# EAGLE design DSLR_controller (EAGLE 7.0.0)
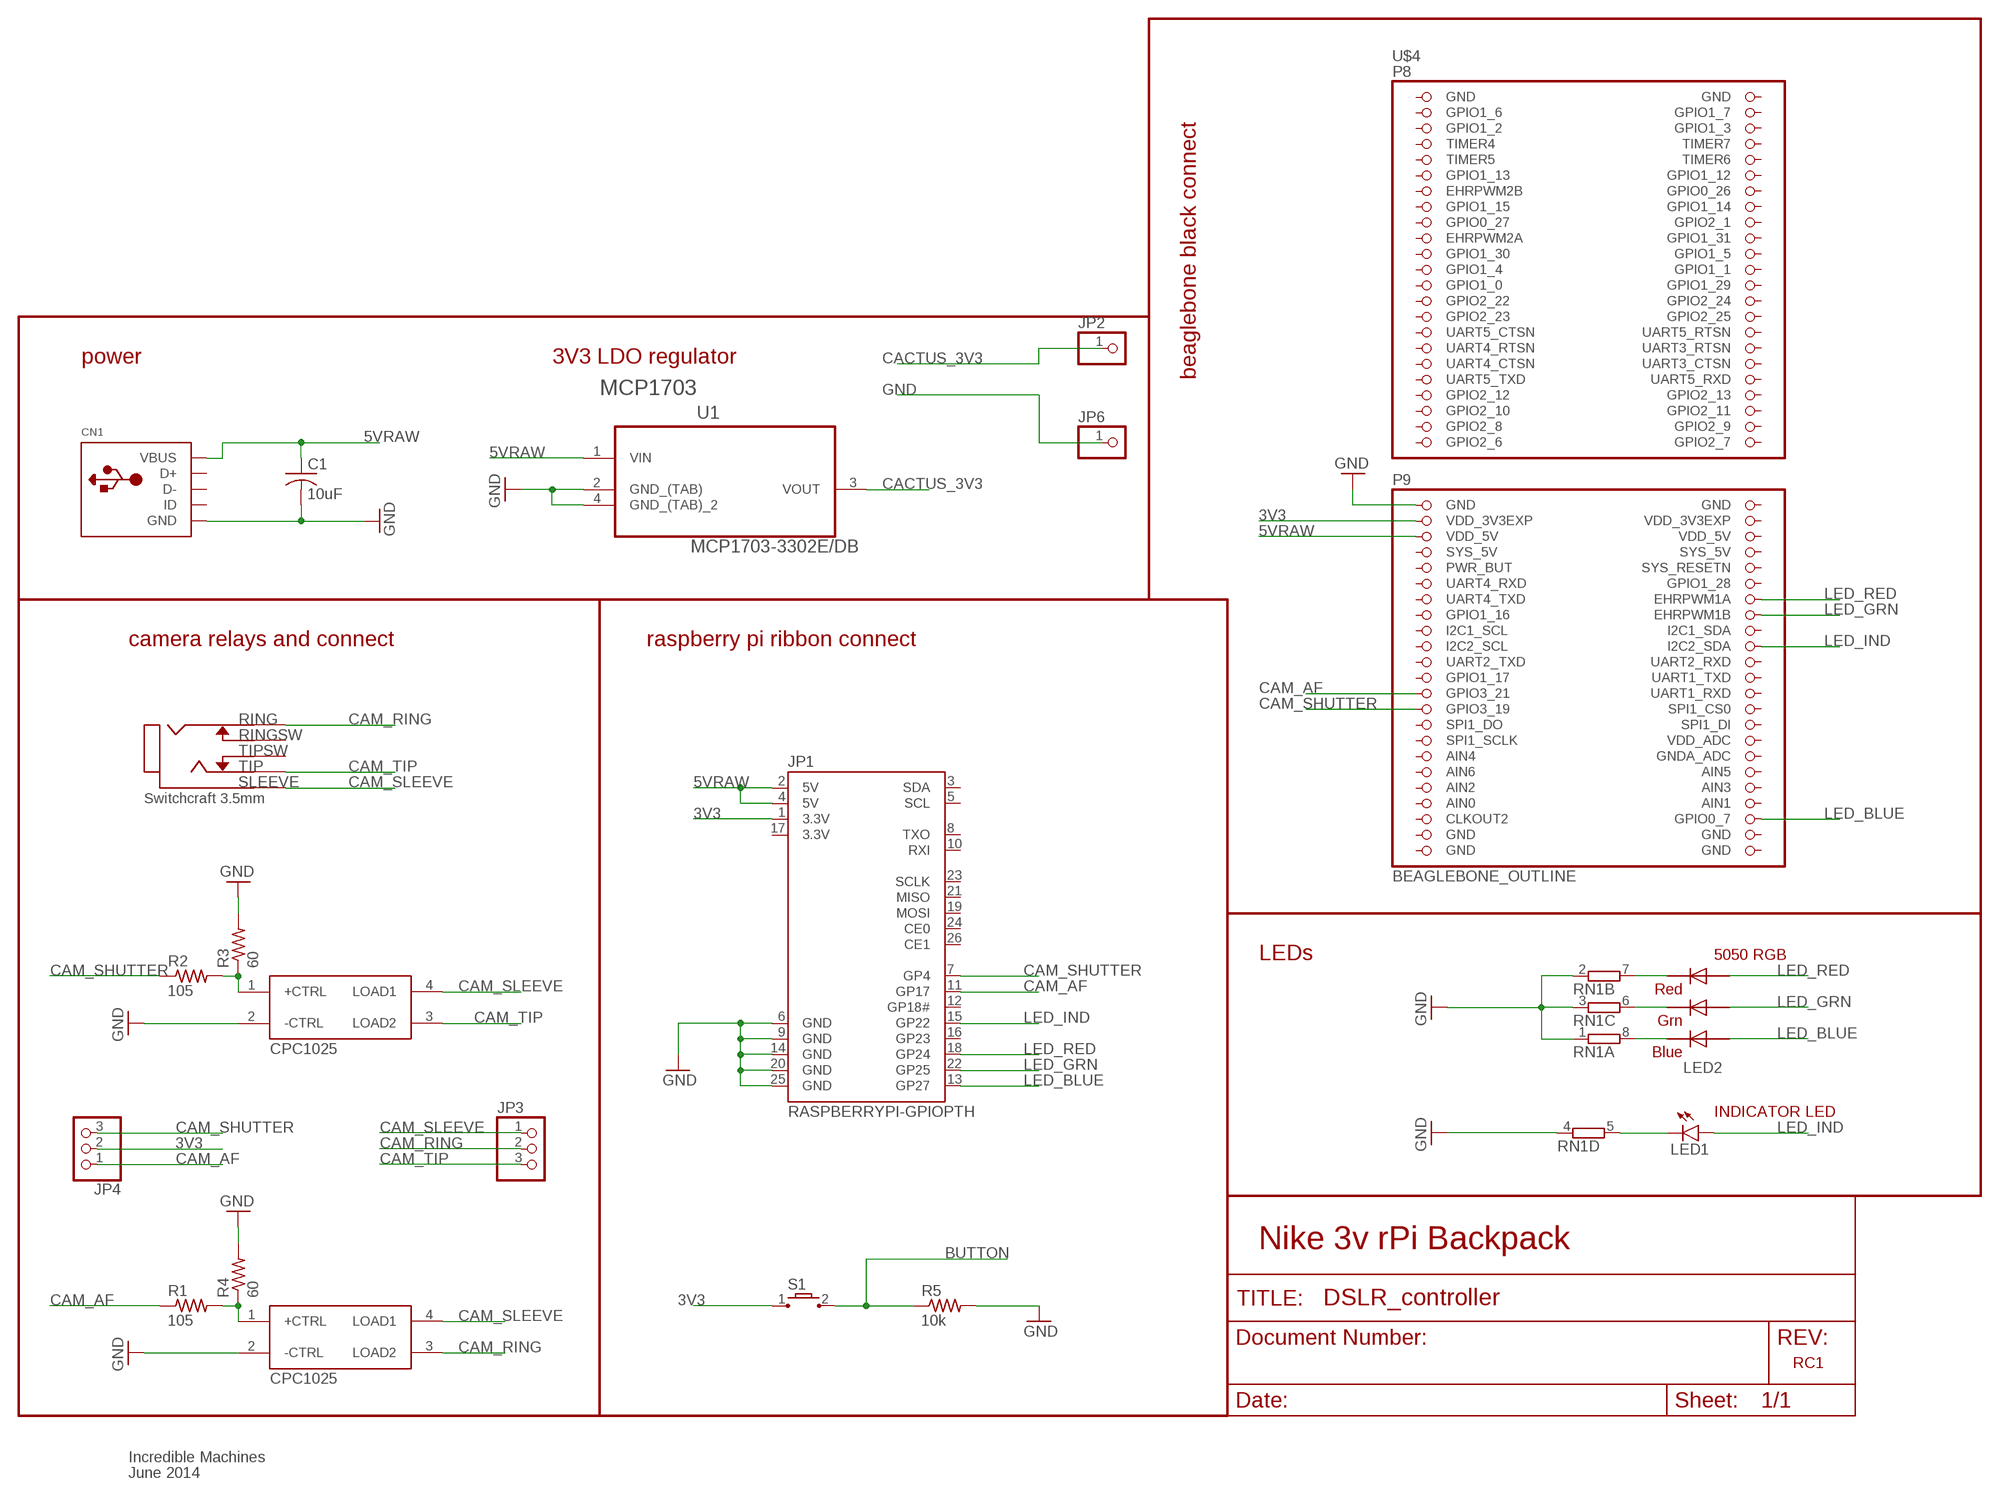
[diagram p0: schematic, sheet 1]

## Parts
C1  10uF  C-USC1206K  [C1206K]
CN1  USBMOLEX  [USB-MINIB-THM-MOLEX]
JP1  RASPBERRYPI-GPIOPTH  [2X13-SHROUDED]
JP2  PINHD-1X1CB  [1X01-CLEANBIG]
JP3  PINHD-1X3CB  [1X03-CLEANBIG]
JP4  PINHD-1X3CB  [1X03-CLEANBIG]
JP6  PINHD-1X1CB  [1X01-CLEANBIG]
LED1  LED1206  [LED-1206]
LED2  RGBLED5050  [RGBLED5050]
R1  105  R-US_R1206  [R1206]
R2  105  R-US_R1206  [R1206]
R3  60  R-US_R1206  [R1206]
R4  60  R-US_R1206  [R1206]
R5  10k  R-US_R1206  [R1206]
RN1  4R-NEXBS8V  [EXBS8V]
S1  TL3302-G  [TL3302_GULL_WING]
U1  MCP1703-3302E/DB  [SOT230P700X180-4N]
U$1  SWTCHCRFT_3.5JACK5-JACK-SMD  [4-JACK-SMD]
U$2  CPC1025_OPTORELAY  [4-OPTORELAY]
U$3  CPC1025_OPTORELAY  [4-OPTORELAY]
U$4  BEAGLEBONE_OUTLINE  [BEAGLEBONE_SHIELD]

## Nets
3V3: JP1.1(3.3V) JP4.2 S1.1 U$4.49(VDD_3V3EXP)
5VRAW: C1.1 CN1.VBUS JP1.2(5V) JP1.4(5V) U1.1(VIN) U$4.51(VDD_5V)
BUTTON: R5.1 S1.2
CACTUS_3V3: JP2.1 U1.3(VOUT)
CAM_AF: JP1.11(GP17) JP4.1 R1.1 U$4.71(GPIO3_21)
CAM_RING: JP3.2 U$1.2 U$2.3(LOAD2)
CAM_SHUTTER: JP1.7(GP4) JP4.3 R2.1 U$4.73(GPIO3_19)
CAM_SLEEVE: JP3.1 U$1.1 U$2.4(LOAD1) U$3.4(LOAD1)
CAM_TIP: JP3.3 U$1.3 U$3.3(LOAD2)
GND: C1.2 CN1.GND JP1.6(GND) JP1.9(GND) JP1.14(GND) JP1.20(GND) JP1.25(GND) JP6.1 R3.2 R4.2 R5.2 RN1.1 RN1.2 RN1.3 RN1.4 U1.2(GND_(TAB)) U1.4(GND_(TAB)_2) U$2.2(-CTRL) U$3.2(-CTRL) U$4.47(GND)
LED_BLUE: JP1.13(GP27) LED2.3(BLUE_A) U$4.88(GPIO0_7)
LED_GRN: JP1.22(GP25) LED2.1(GREEN_A) U$4.62(EHRPWM1B)
LED_IND: JP1.15(GP22) LED1.A U$4.66(I2C2_SDA)
LED_RED: JP1.18(GP24) LED2.2(RED_A) U$4.60(EHRPWM1A)
N$1: LED2.6(GREEN_C) RN1.6
N$2: LED2.5(RED_C) RN1.7
N$3: LED2.4(BLUE_C) RN1.8
N$4: LED1.C RN1.5
N$6: R1.2 R4.1 U$2.1(+CTRL)
N$7: R2.2 R3.1 U$3.1(+CTRL)
Unconnected: CN1.D+ CN1.D- CN1.ID JP1.3(SDA) JP1.5(SCL) JP1.8(TXO) JP1.10(RXI) JP1.12(GP18#) JP1.16(GP23) JP1.19(MOSI) JP1.21(MISO) JP1.23(SCLK) JP1.24(CE0) JP1.26(CE1) U$1.4 U$1.5 U$4.3(GPIO1_6) U$4.4(GPIO1_7) U$4.5(GPIO1_2) U$4.6(GPIO1_3) U$4.7(TIMER4) U$4.8(TIMER7) U$4.9(TIMER5) U$4.10(TIMER6) U$4.11(GPIO1_13) U$4.12(GPIO1_12) U$4.13(EHRPWM2B) U$4.14(GPIO0_26) U$4.15(GPIO1_15) U$4.16(GPIO1_14) U$4.17(GPIO0_27) U$4.18(GPIO2_1) U$4.19(EHRPWM2A) U$4.20(GPIO1_31) U$4.21(GPIO1_30) U$4.22(GPIO1_5) U$4.23(GPIO1_4) U$4.24(GPIO1_1) U$4.25(GPIO1_0) U$4.26(GPIO1_29) U$4.27(GPIO2_22) U$4.28(GPIO2_24) U$4.29(GPIO2_23) U$4.30(GPIO2_25) U$4.31(UART5_CTSN) U$4.32(UART5_RTSN) U$4.33(UART4_RTSN) U$4.34(UART3_RTSN) U$4.35(UART4_CTSN) U$4.36(UART3_CTSN) U$4.37(UART5_TXD) U$4.38(UART5_RXD) U$4.39(GPIO2_12) U$4.40(GPIO2_13) U$4.41(GPIO2_10) U$4.42(GPIO2_11) U$4.43(GPIO2_8) U$4.44(GPIO2_9) U$4.45(GPIO2_6) U$4.46(GPIO2_7) U$4.54(SYS_5V) U$4.55(PWR_BUT) U$4.56(SYS_RESETN) U$4.57(UART4_RXD) U$4.58(GPIO1_28) U$4.59(UART4_TXD) U$4.61(GPIO1_16) U$4.63(I2C1_SCL) U$4.64(I2C1_SDA) U$4.65(I2C2_SCL) U$4.67(UART2_TXD) U$4.68(UART2_RXD) U$4.69(GPIO1_17) U$4.70(UART1_TXD) U$4.72(UART1_RXD) U$4.74(SPI1_CS0) U$4.75(SPI1_DO) U$4.76(SPI1_DI) U$4.77(SPI1_SCLK) U$4.78(VDD_ADC) U$4.79(AIN4) U$4.80(GNDA_ADC) U$4.81(AIN6) U$4.82(AIN5) U$4.83(AIN2) U$4.84(AIN3) U$4.86(AIN1) U$4.87(CLKOUT2)

## Notes on the sheet
- power | 3V3 LDO regulator
- beaglebone black connect
- MCP1703
- camera relays and connect | raspberry pi ribbon connect
- LEDs | 5050 RGB
- INDICATOR LED
- Nike 3v rPi Backpack
- RC1
- Incredible Machines
- June 2014

## Power pins joined to a net without a drawn wire
3.3V: JP1.17(3.3V)
AIN0: U$4.85(AIN0)
GND: U$4.1(GND) U$4.2(GND) U$4.48(GND) U$4.89(GND) U$4.90(GND) U$4.91(GND) U$4.92(GND)
SYS_5V: U$4.53(SYS_5V)
VDD_3V3EXP: U$4.50(VDD_3V3EXP)
VDD_5V: U$4.52(VDD_5V)

## Library data of the parts
C1 = adafruit:C-US: CAPACITOR, American symbol
CN1 = adafruit:USB: USB Connectors USBMINIB - Surface Mount Female Mini-B USB Connector 4UConnector: 06564 By microbuilder.eu Thru-hole RA Female Mini-B USB Connector 4UConnector: 18732 By ladyada.net
JP1 = SparkFun-Boards:RASPBERRYPI-GPIO: RASPBERRY PI I/O HEADER As defined for the Revistion 2 Pi.; DIST: sparkfun; DIST_ID: PRT-11490
JP2 JP6 = adafruit:PINHD-1X1: Pin header 1x1 for 0.1" spacing With round pins
JP3 JP4 = adafruit:PINHD-1X3: PIN HEADER
LED1 = SparkFun-LED:LED: LEDs Standard schematic elements and footprints for 5mm, 3mm, 1206, and 0603 sized LEDs. 5mm - Spark Fun Electronics SKU : COM-00529 (and others)
LED2 = adafruit:RGBLED: For 5050 RGB LEDs, the order of the LEDs may vary from one manufacturer to another!
R1-R5 = adafruit:R-US_: RESISTOR, American symbol
RN1 = resistor-dil:4R-N: Array Chip Resistor Source: RS Component / Phycomp; OC_FARNELL: unknown; OC_NEWARK: unknown
S1 = eswitch-tact:TL3302: E-Switch TL3302 Series Tactile Switch Surface mount button commonly used for reset or general input. 3.5 x 6mm packaged design. -G: Gull wing termination. Parts TL-3302-x-xxxx-x-G -J: J-Lead termination. Parts TL-3302-x-xxxx-x-J Source: http://www.e-switch.com/Portals/0/Series_Pdf/TL3302.pdf Supplier: DigiKey: http://be.digikey.com/scripts/dksearch/dksus.dll?vendor=0&keywords=TL3302
U1 = Microchip_By_element14_Batch_1:MCP1703-3302E/DB: IC REG LDO 3.3V 250MA; MPN: MCP1703-3302E/DB; OC_FARNELL: 1627177; OC_NEWARK: 40M0623; PACKAGE: SOT-223-3; SUPPLIER: Microchip
U$1 = jmsaavedra:SWTCHCRFT_3.5JACK: Switchcraft 3.5mm Stereo Audio Jack manufacturer: 35RASMT4BHNTRX digikey: SC1488-1-ND
U$2 U$3 = jmsaavedra:CPC1025_OPTORELAY: CPC1025N Solid State Relay IXYS part: CPC1025NTR digikey part: CLA234CT-ND http://www.clare.com/home/pdfs.nsf/www/CPC1025N.pdf/$file/CPC1025N.pdf
U$4 = adafruit:BEAGLEBONE_OUTLINE: Should match A3 pinout - but not completely tested

## Net classes
0 default: width 0.305 mm
1 VCC: width 0.381 mm

## Board
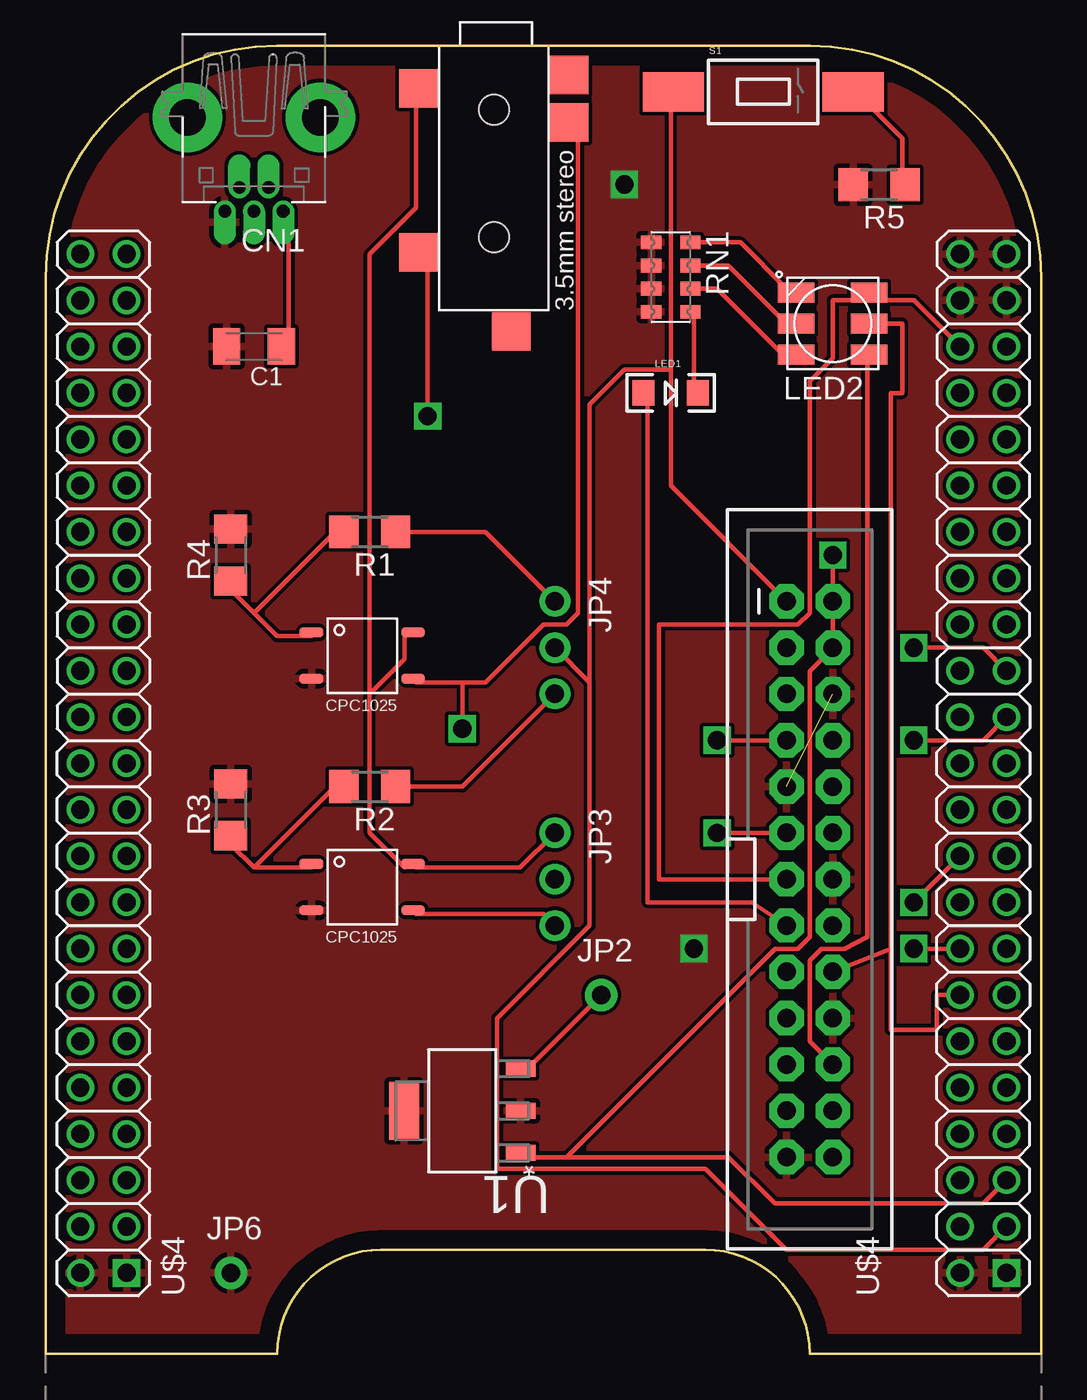
[diagram p1: board, top side]
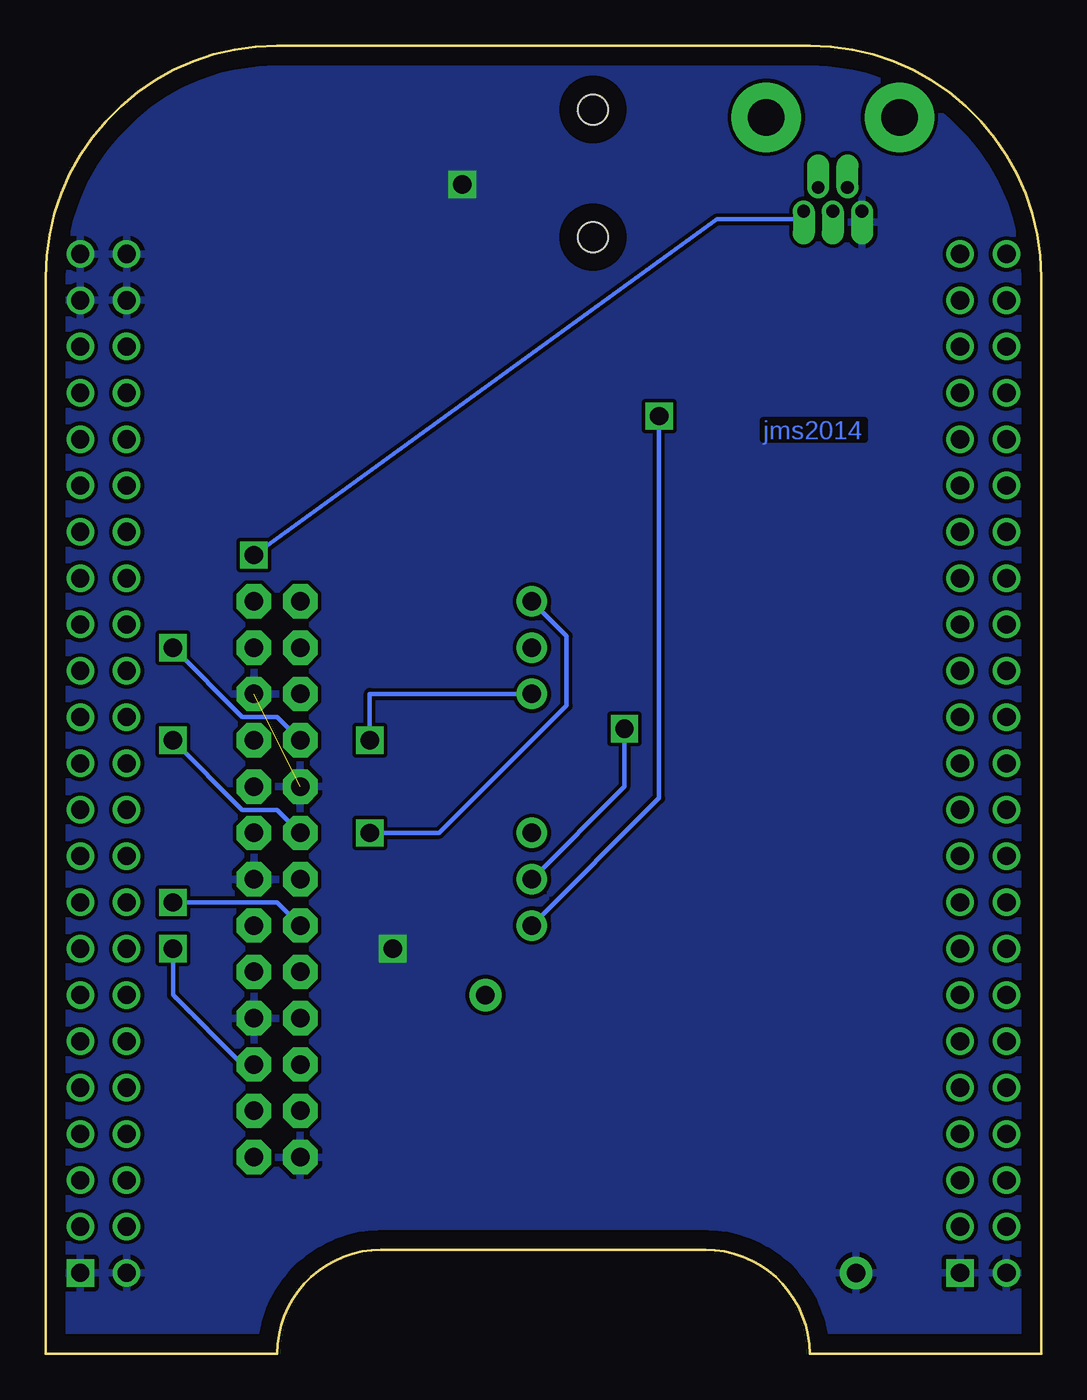
[diagram p2: board, bottom side, seen from below]

Size 54.61 x 71.75 mm. Coordinates in mm from the lower left corner, seen from the top.
Copper layers (1*16): Top 0.035mm / dielectric 1.5mm / Bottom 0.035mm
Design rules "default": minimum track width 10mil, minimum drill 24mil, track to track 8mil, track to pad 8mil, pad to pad 8mil, via to via 8mil, smd to smd 8mil, copper to edge 40mil, drill to drill 8mil, minimum pad ring 10mil, minimum via ring 8mil, stop-mask expansion 4mil, vias tented up to drill 0mil, thermal gap 10mil

### Footprints (pad centres in the part's own frame; a part is rotated, then mirrored left to right if it is on the bottom)
C1206K = smd 1.5 x 2: 1 -1.5,0; 2 1.5,0
USB-MINIB-THM-MOLEX = drill 0.7 offset: D+ 0,9.72; D- -0.8,8.42; GND 1.6,9.72; ID 0.8,8.42; VBUS -1.6,9.72 | drill 2 pad 3.81: GND1 -3.65,4.57; GND4 3.65,4.57
2X13-SHROUDED = drill 1.016 pad 1.88 octagon: 1 -1.27,15.24; 2 1.27,15.24; 3 -1.27,12.7; 4 1.27,12.7; 5 -1.27,10.16; 6 1.27,10.16; 7 -1.27,7.62; 8 1.27,7.62; 9 -1.27,5.08; 10 1.27,5.08; 11 -1.27,2.54; 12 1.27,2.54; 13 -1.27,0; 14 1.27,0; 15 -1.27,-2.54; 16 1.27,-2.54; 17 -1.27,-5.08; 18 1.27,-5.08; 19 -1.27,-7.62; 20 1.27,-7.62; 21 -1.27,-10.16; 22 1.27,-10.16; 23 -1.27,-12.7; 24 1.27,-12.7; 25 -1.27,-15.24; 26 1.27,-15.24
1X01-CLEANBIG = drill 1.016 pad 1.778: 1 0,0
1X03-CLEANBIG = drill 1.016 pad 1.676: 1 -2.54,0; 2 0,0; 3 2.54,0
LED-1206 = smd 1.2 x 1.4: A -1.5,0; C 1.5,0
RGBLED5050 = smd 2 x 1.1: 1 -2,1.7; 2 -2,0; 3 -2,-1.7; 4 2,-1.7; 5 2,0; 6 2,1.7
R1206 = smd 1.6 x 1.803: 1 -1.422,0; 2 1.422,0
EXBS8V = smd 0.75 x 1.1: 1 -1.905,-1.07; 2 -0.635,-1.07; 3 0.635,-1.07; 4 1.905,-1.07; 5 1.905,1.07; 6 0.635,1.07; 7 -0.635,1.07; 8 -1.905,1.07
TL3302_GULL_WING = smd 3.35 x 2.16: 1 -4.925,0; 2 4.925,0
SOT230P700X180-4N = smd 1.626 x 0.889: 1 -3.2,2.311; 2 -3.2,0; 3 -3.2,-2.311 | smd 1.626 x 3.175: 4 3.2,0
4-JACK-SMD = smd 2.108 x 2.108: 1 2.362,-1.143; 2 4.216,7.137; 3 11.354,-1.143; 4 1.6,7.137; 5 15.672,3.962 | hole 1.651: 3.505,2.997; 10.516,2.997
4-OPTORELAY = smd 1.3 x 0.559: 1 -0.66,3.378; 2 -0.66,0.838; 3 4.928,0.838; 4 4.928,3.378
BEAGLEBONE_SHIELD = drill 1 square: 1 4.445,19.05; 47 52.705,19.05 | drill 1: 2 1.905,19.05; 3 4.445,21.59; 4 1.905,21.59; 5 4.445,24.13; 6 1.905,24.13; 7 4.445,26.67; 8 1.905,26.67; 9 4.445,29.21; 10 1.905,29.21; 11 4.445,31.75; 12 1.905,31.75; 13 4.445,34.29; 14 1.905,34.29; 15 4.445,36.83; 16 1.905,36.83; 17 4.445,39.37; 18 1.905,39.37; 19 4.445,41.91; 20 1.905,41.91; 21 4.445,44.45; 22 1.905,44.45; 23 4.445,46.99; 24 1.905,46.99; 25 4.445,49.53; 26 1.905,49.53; 27 4.445,52.07; 28 1.905,52.07; 29 4.445,54.61; 30 1.905,54.61; 31 4.445,57.15; 32 1.905,57.15; 33 4.445,59.69; 34 1.905,59.69; 35 4.445,62.23; 36 1.905,62.23; 37 4.445,64.77; 38 1.905,64.77; 39 4.445,67.31; 40 1.905,67.31; 41 4.445,69.85; 42 1.905,69.85; 43 4.445,72.39; 44 1.905,72.39; 45 4.445,74.93; 46 1.905,74.93; 48 50.165,19.05; 49 52.705,21.59; 50 50.165,21.59; 51 52.705,24.13; 52 50.165,24.13; 53 52.705,26.67; 54 50.165,26.67; 55 52.705,29.21; 56 50.165,29.21; 57 52.705,31.75; 58 50.165,31.75; 59 52.705,34.29; 60 50.165,34.29; 61 52.705,36.83; 62 50.165,36.83; 63 52.705,39.37; 64 50.165,39.37; 65 52.705,41.91; 66 50.165,41.91; 67 52.705,44.45; 68 50.165,44.45; 69 52.705,46.99; 70 50.165,46.99; 71 52.705,49.53; 72 50.165,49.53; 73 52.705,52.07; 74 50.165,52.07; 75 52.705,54.61; 76 50.165,54.61; 77 52.705,57.15; 78 50.165,57.15; 79 52.705,59.69; 80 50.165,59.69; 81 52.705,62.23; 82 50.165,62.23; 83 52.705,64.77; 84 50.165,64.77; 85 52.705,67.31; 86 50.165,67.31; 87 52.705,69.85; 88 50.165,69.85; 89 52.705,72.39; 90 50.165,72.39; 91 52.705,74.93; 92 50.165,74.93

### Placement (x,y rotation side)
C1  11.43,55.25 180 top
CN1  11.43,72.39 180 top
JP1  41.91,26.04 0 top
JP2  30.48,19.69 0 top
JP3  27.94,26.04 270 top
JP4  27.94,38.73 270 top
JP6  10.16,4.45 0 top
LED1  34.29,52.71 0 top
LED2  43.18,56.52 180 top
R1  17.78,45.09 180 top
R2  17.78,31.12 180 top
R3  10.16,29.84 90 top
R4  10.16,43.82 90 top
R5  45.72,64.13 180 top
RN1  34.29,59.05 270 top
S1  39.37,69.21 0 top
U1  22.86,13.34 180 top
U$1  21.59,71.75 270 top
U$2  15.24,36.2 0 top
U$3  15.24,23.49 0 top
U$4  0,-14.61 0 top

### Tracks (layer width: path | path; a pad name or v marks a point on that pad's centre or on a via)
3V3
  Top 0.254: 34.29,53.98 34.29,47.62 JP1.1 | 34.29,53.98 34.29,69.21 S1.1 | U$4.49 51.44,5.71 40.64,5.71 36.2,10.16 24.77,10.16 24.77,18.41 29.84,23.49 29.84,36.83 | JP4.2 29.84,36.83 | 34.29,53.98 31.75,53.98 29.84,52.07 29.84,36.83
5VRAW  (via drill 1)
  Top 0.254: C1.1 13.34,55.25 13.34,62.23 CN1.VBUS | 28.57,10.79 37.47,10.79 40.01,8.26 51.44,8.26 U$4.51 | 28.57,10.79 26.67,10.79 U1.1 | 28.57,10.79 40.01,22.23 41.27,22.23 41.91,22.86 41.91,37.47 JP1.4 JP1.2 v43.18,43.82
  Bottom 0.254: v43.18,43.82 17.78,62.23 13.34,62.23 CN1.VBUS
BUTTON
  Top 0.254: R5.1 46.99,64.13 46.99,66.67 44.45,69.21 S1.2
CACTUS_3V3
  Top 0.254: JP2.1 26.67,15.88 U1.3
CAM_AF  (via drill 1)
  Top 0.254: R1.1 24.13,45.09 JP4.1 | U$4.71 51.44,33.66 v47.62,33.66 | JP1.11 v36.83,28.58
  Bottom 0.254: v47.62,33.66 43.81,29.84 41.91,29.84 JP1.11 | JP4.1 26.04,39.37 26.04,35.56 33.02,28.58 v36.83,28.58
CAM_RING  (via drill 1)
  Top 0.254: 22.86,36.83 24.13,36.83 27.3,40.01 28.57,40.01 29.21,40.64 29.21,67.31 U$1.2 | 22.86,36.83 20.32,36.83 U$2.3 | 22.86,36.83 v22.86,34.29
  Bottom 0.254: JP3.2 22.86,31.12 v22.86,34.29
CAM_SHUTTER  (via drill 1)
  Top 0.254: R2.1 22.86,31.12 JP4.3 | U$4.73 51.44,38.73 v47.62,38.73 | JP1.7 v36.83,33.66
  Bottom 0.254: v47.62,38.73 43.81,34.93 41.91,34.93 JP1.7 | v36.83,33.66 36.83,36.2 JP4.3
CAM_SLEEVE
  Top 0.254: JP3.1 26.04,26.67 20.32,26.67 U$3.4 19.68,26.67 17.78,28.58 17.78,36.2 | 17.78,36.2 19.68,38.1 19.68,39.37 U$2.4 | 17.78,36.2 17.78,60.33 20.32,62.87 20.32,69.21 U$1.1
CAM_TIP  (via drill 1)
  Top 0.254: JP3.3 27.3,24.13 20.32,24.13 U$3.3 | v20.95,51.44 20.95,60.33 U$1.3
  Bottom 0.254: v20.95,51.44 20.95,30.48 JP3.3
GND  (via drill 1)  (1 unrouted)
  other vias: 31.75,64.13 35.56,22.23
  pour Top: -26.67,94.61 -33.02,94.61 -33.02,-14.61 86.36,-14.61 86.36,95.88 -26.67,95.88
  pour Bottom: -17.78,84.45 71.12,84.45 71.12,81.91 71.12,-6.98 -12.7,-6.98 -12.7,-3.17 -17.78,-3.17
LED_BLUE
  Top 0.254: U$4.88 47.62,57.79 45.72,57.79 LED2.3 45.09,57.79 43.18,57.79 43.18,54.61 41.91,53.34 41.91,40.64 41.27,40.01 33.66,40.01 33.66,26.04 JP1.13
LED_GRN  (via drill 1)
  Top 0.254: JP1.22 41.91,17.15 41.91,21.59 42.55,22.23 43.81,22.23 45.09,22.86 45.09,55.25 LED2.1 | v47.62,22.23 U$4.62
  Bottom 0.254: v47.62,22.23 47.62,19.69 43.81,15.88 JP1.22
LED_IND  (via drill 1)
  Top 0.254: JP1.15 38.73,24.77 33.02,24.77 33.02,52.71 LED1.A | v47.62,24.77 U$4.66
  Bottom 0.254: v47.62,24.77 41.91,24.77 JP1.15
LED_RED
  Top 0.254: LED2.2 46.99,56.52 46.99,52.71 46.35,52.71 46.35,22.23 | U$4.60 48.9,19.69 48.9,19.05 48.9,17.78 46.35,17.78 46.35,22.23 | 46.35,22.23 JP1.18
N$1
  Top 0.254: RN1.6 36.83,58.42 40.64,54.61 LED2.6
N$2
  Top 0.254: RN1.7 37.47,59.69 40.64,56.52 LED2.5
N$3
  Top 0.254: RN1.8 38.1,60.96 40.64,58.42 LED2.4
N$4
  Top 0.254: RN1.5 35.56,57.15 35.56,52.71 LED1.C
N$6
  Top 0.254: 11.43,40.64 10.16,41.91 R4.1 | 11.43,40.64 12.7,39.37 14.61,39.37 U$2.1 | 11.43,40.64 15.88,45.09 R1.2
N$7
  Top 0.254: 11.43,26.67 14.61,26.67 U$3.1 | 11.43,26.67 10.16,27.94 R3.1 | 11.43,26.67 15.88,31.12 R2.2

### Text on the board
Bottom: jms2014